# EAGLE design cociclo_05 (EAGLE 8.6.0)
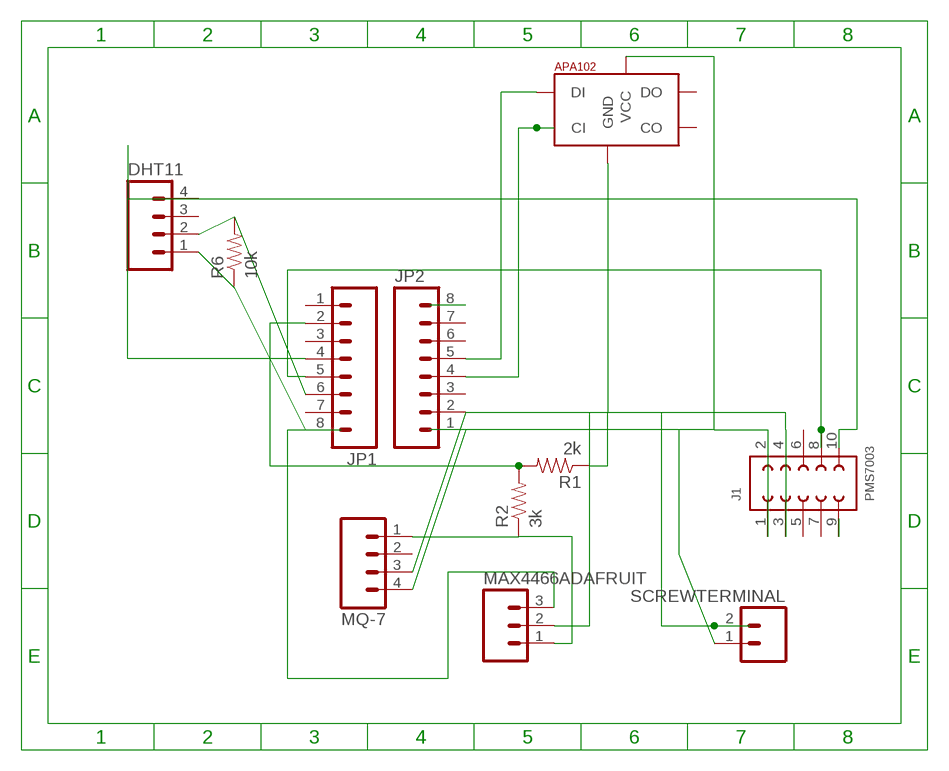
[diagram p0: schematic, sheet 1]

## Parts
DHT11  M04PTH  [1X04]
J1  PMS7003  621X1021021  [621X1021021]
JP1  M08  [1X08_ROUND]
JP2  M08  [1X08_ROUND]
MAX4466ADAFRUIT  M03PTH  [1X03]
MQ-7  M04PTH  [1X04]
R1  2k  RESISTOR1206  [1206]
R2  3k  RESISTOR1206  [1206]
R6  10k  RESISTOR1206  [1206]
SCREWTERMINAL  M023.5MM  [SCREWTERMINAL-3.5MM-2]
SK9822LED  APA1025050  [APA102_5050]

## Nets
7RX: J1.8 JP1.5
9TX: J1.10 JP1.4
10SET: J1.9
+5V: J1.1 J1.2 JP2.1 MQ-7.4 SCREWTERMINAL.1 SK9822LED.1(VCC)
ADC: JP1.2 R1.2 R2.2
CH_PD: DHT11.1 JP1.8 MAX4466ADAFRUIT.3 R6.1
D2: JP2.5 SK9822LED.4(DI)
GND: DHT11.4 J1.3 J1.4 JP2.2 MAX4466ADAFRUIT.2 MQ-7.3 R1.1 SCREWTERMINAL.2 SK9822LED.6(GND)
GPIO14: DHT11.2 JP1.6 R6.2
MQ7ANALOG: MAX4466ADAFRUIT.1 MQ-7.1 R2.1
N$10: JP2.4 SK9822LED.5(CI)
N$14: JP2.8
Unconnected: DHT11.3 J1.5 J1.6 J1.7 JP1.1 JP1.3 JP1.7 JP2.3 JP2.6 JP2.7 MQ-7.2 SK9822LED.2(CO) SK9822LED.3(DO)

## Library data of the parts
DHT11 MQ-7 = SparkFun-Connectors:M04: Header 4 Standard 4-pin 0.1" header. Use with straight break away headers (SKU : PRT-00116), right angle break away headers (PRT-00553), swiss pins (PRT-00743), machine pins (PRT-00117), and female headers (PRT-00115). Molex polarized connector foot print use with SKU : PRT-08231 with associated crimp pins and housings. 1MM SMD Version SKU: PRT-10208
J1 = Board-to-Board (rev18a):621X1021021: WR-PHD 1.27mm Dual SMT Pin Header H=3.80 mm, 10 Pins=>Code : Con_BTB_PHD_1.27_2_621x1021021(Packaging:x = 0: Tube x = 3: Tape & Reel with Cap) <http://katalog.we-online.de/media/thumbs2/eican/thb_Con_BTB_PHD_1.27_2_6210xx21021_pf2.jpg> 6210xx21021 Details see: http://katalog.we-online.de/en/em/621_0xx_210_21 6213xx21021 Details see: http://katalog.we-online.de/en/em/PHD_1_27_SMT_DUAL_PIN_HEADER_REEL_6213XX21021 2014 (C) Würth Elektronik
JP1 JP2 = SparkFun-Connectors:M08: Header 8 Standard 8-pin 0.1" header. Use with straight break away headers (SKU : PRT-00116), right angle break away headers (PRT-00553), swiss pins (PRT-00743), machine pins (PRT-00117), and female headers (PRT-00115).
MAX4466ADAFRUIT = SparkFun-Connectors:M03: Header 3 Standard 3-pin 0.1" header. Use with straight break away headers (SKU : PRT-00116), right angle break away headers (PRT-00553), swiss pins (PRT-00743), machine pins (PRT-00117), and female headers (PRT-00115). Molex polarized connector foot print use with SKU : PRT-08232 with associated crimp pins and housings.
R1 R2 R6 = SparkFun-Resistors:RESISTOR: Resistor Basic schematic elements and footprints for 0603, 1206, and PTH resistors.
SCREWTERMINAL = SparkFun-Connectors:M02: Standard 2-pin 0.1" header. Use with - straight break away headers ( PRT-00116) - right angle break away headers (PRT-00553) - swiss pins (PRT-00743) - machine pins (PRT-00117) - female headers (PRT-00115) Molex polarized connector foot print use with: PRT-08233 with associated crimp pins and housings. 2.54_SCREWTERM for use with PRT-10571. 3.5mm Screw Terminal footprints for PRT-08084 5mm Screw Terminal footprints for use with PRT-08432; PROD_ID: CONN-08399
SK9822LED = jos-ph:APA102: APA102C 5050 RGB LED -- Adafruit DotStar Single LED Pixel Product Page: https://www.adafruit.com/products/2343 Datasheet: https://cdn-shop.adafruit.com/product-files/2343/APA102C.pdf

## Board
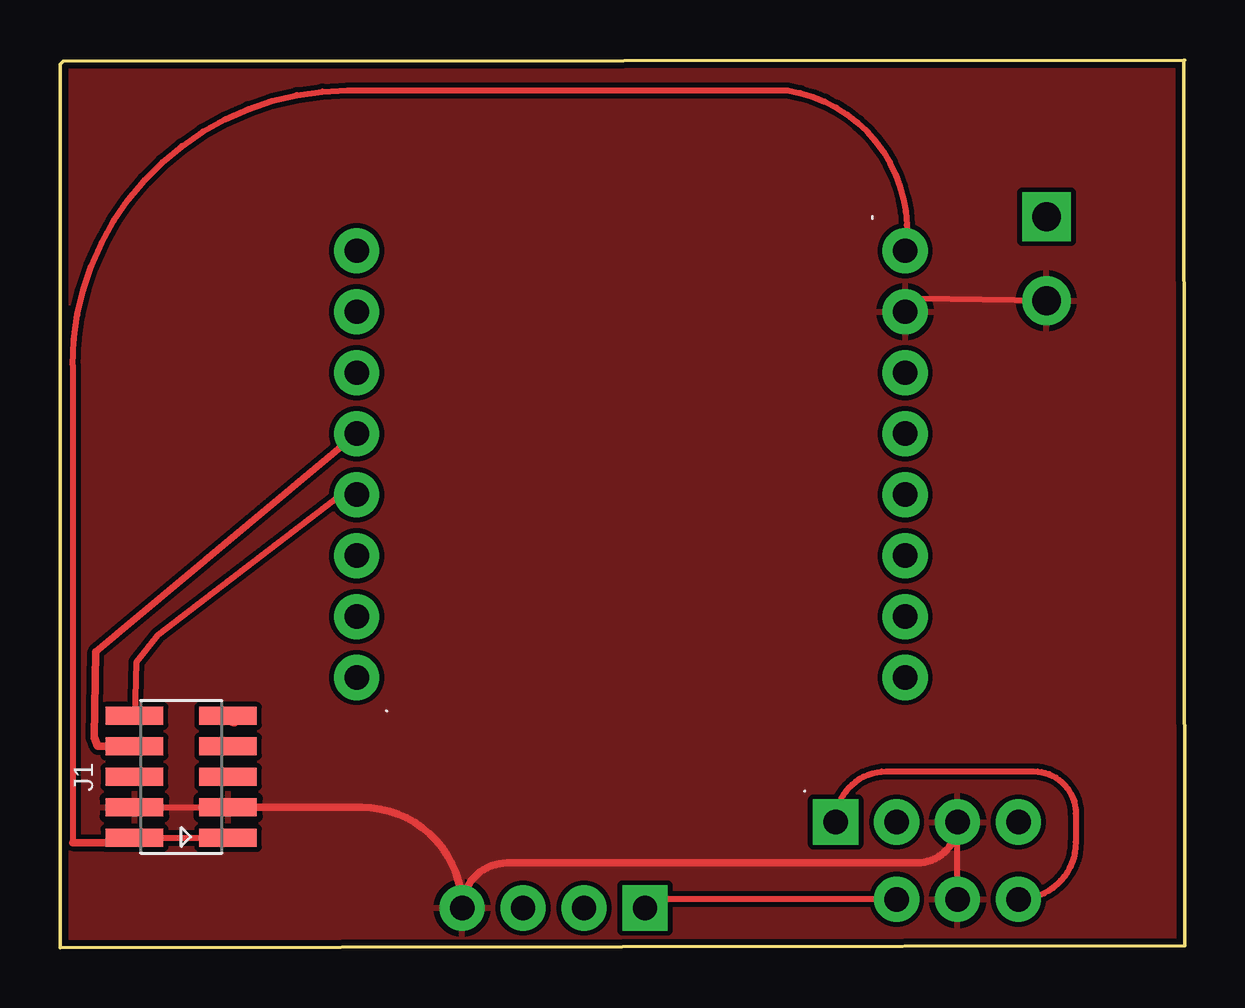
[diagram p1: board, top side]
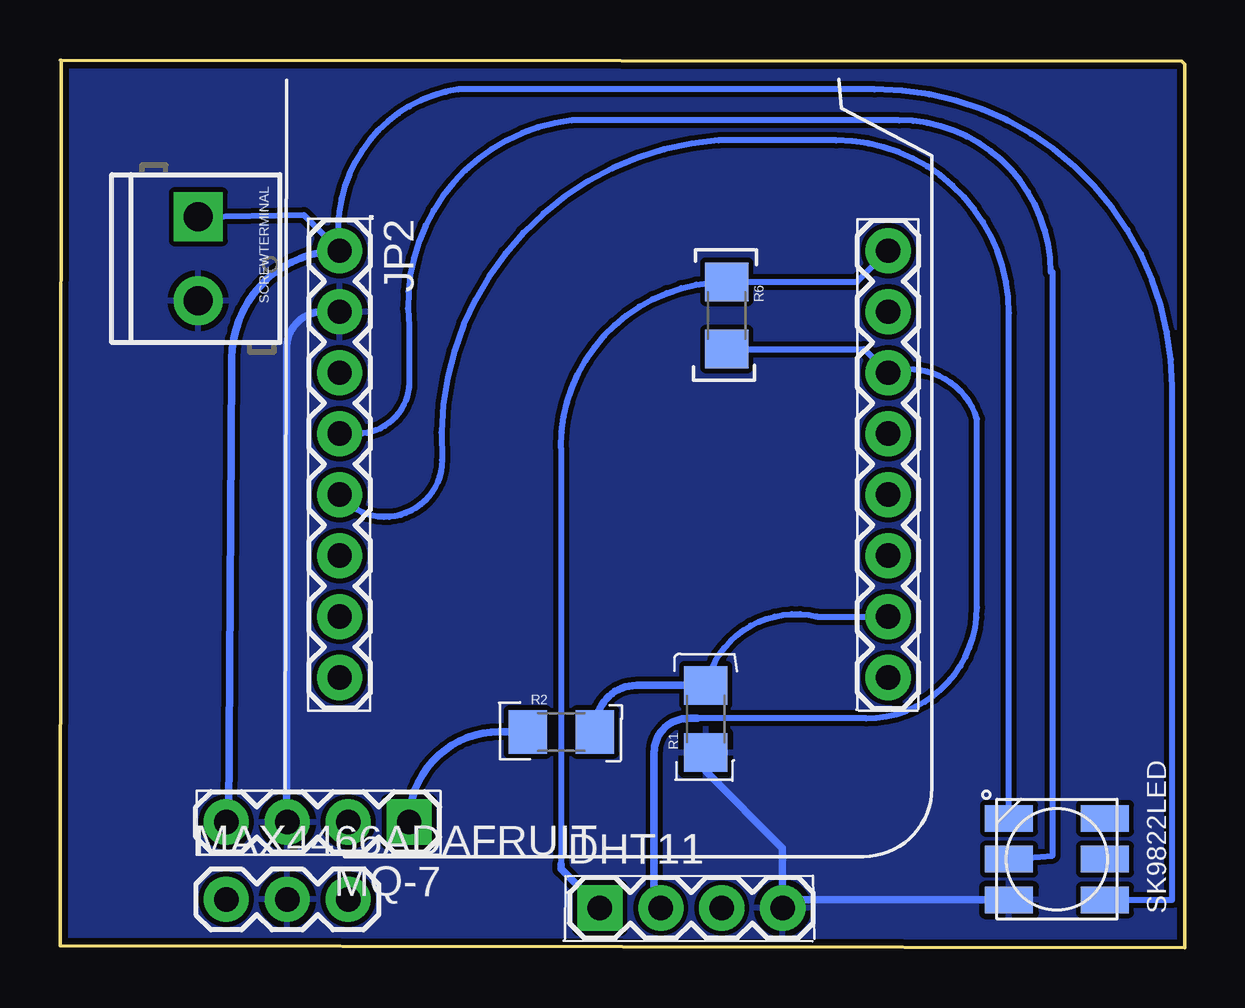
[diagram p2: board, bottom side, seen from below]

Size 46.89 x 36.98 mm. Coordinates in mm from the lower left corner, seen from the top.
Outline: 46.84,36.98 46.89,0.08 0,0 0,36.8 0.13,36.93 46.89,36.98
Copper layers (1*16): Top 0.035mm / dielectric 1.5mm / Bottom 0.035mm
Design rules "adafruit *": minimum track width 10mil, minimum drill 15.5mil, track to track 8mil, track to pad 8mil, pad to pad 8mil, via to via 8mil, smd to smd 8mil, copper to edge 10mil, drill to drill 8mil, minimum pad ring 10mil, minimum via ring 8mil, stop-mask expansion 2mil, vias tented up to drill 20mil, thermal gap 10mil

### Footprints (pad centres in the part's own frame; a part is rotated, then mirrored left to right if it is on the bottom)
1X04 = drill 1.016 pad 1.88 square: 1 0,0 | drill 1.016 pad 1.88: 2 2.54,0; 3 5.08,0; 4 7.62,0
621X1021021 = smd 0.75 x 2.4: 1 -2.54,-1.95; 2 -2.54,1.95; 3 -1.27,-1.95; 4 -1.27,1.95; 5 0,-1.95; 6 0,1.95; 7 1.27,-1.95; 8 1.27,1.95; 9 2.54,-1.95; 10 2.54,1.95
1X08_ROUND = drill 1.016 pad 1.88: 1 0,0; 2 2.54,0; 3 5.08,0; 4 7.62,0; 5 10.16,0; 6 12.7,0; 7 15.24,0; 8 17.78,0
1X03 = drill 1.016 pad 1.88: 1 0,0; 2 2.54,0; 3 5.08,0
1206 = smd 1.6 x 1.8: 1 -1.4,0; 2 1.4,0
SCREWTERMINAL-3.5MM-2 = drill 1.2 pad 2.032 square: 1 0,0 | drill 1.2 pad 2.032: 2 3.5,0
APA102_5050 = smd 2 x 1.1: 1 2,-1.7; 2 2,0; 3 2,1.7; 4 -2,1.7; 5 -2,0; 6 -2,-1.7

### Placement (x,y rotation side)
DHT11  24.38,1.65 0 bottom
J1  5.05,7.11 90 top
JP1  12.37,11.25 90 bottom
JP2  35.23,29.03 270 bottom
MAX4466ADAFRUIT  39.95,2.01 0 bottom
MQ-7  32.33,5.23 180 bottom
R1  19.97,9.52 90 bottom
R2  25.99,8.99 0 bottom
R6  19.1,26.34 270 bottom
SCREWTERMINAL  41.12,30.45 270 bottom
SK9822LED  5.33,3.68 0 bottom

### Tracks (layer width: path | path; a pad name or v marks a point on that pad's centre or on a via)
7RX
  Top 0.305: 3.03,8.31 J1.8 1.57,8.38 1.42,8.76 1.5,12.32 JP1.5
9TX
  Top 0.254: JP1.4 11.71,18.87 4.07,13.01 3.18,11.89 J1.10
10SET
  Top 0.305: 7.28,9.37 arc-90 J1.9
+5V
  Top 0.254: J1.2 3.3,4.57 J1.1 | 0.53,4.37 0.53,24.26 arc-90 11.99,35.71 30.33,35.71 arc-90 JP2.1
  Top 0.305: 0.53,4.37 3.1,4.37 arc90 3.3,4.57
  Bottom 0.254: SK9822LED.1 0.53,1.98 0.53,23.37 arc-90 12.93,35.76 30.28,35.76 arc-90 JP2.1 36.73,30.53 SCREWTERMINAL.1
  Bottom 0.305: MQ-7.4 arc-90 39.85,5.33 39.73,24.21 39.73,24.54 arc90 JP2.1
ADC
  Bottom 0.254: 24.64,9.15 24.68,9.1 | R1.2 arc90 15.32,13.79 JP1.2
  Bottom 0.305: R1.2 22.86,10.93 arc-90 24.56,9.22
  Bottom 0.61: 24.56,9.22 arc90 24.68,9.1 24.68,9.6 arc90 R2.2
CH_PD
  Top 0.254: MAX4466ADAFRUIT.3 24.74,2.01 arc90 DHT11.1
  Bottom 0.254: JP1.8 13.66,27.74 R6.1 arc-90 26.01,20.83 26.01,3.48
  Bottom 0.305: 26.01,3.48 26.01,3.28 DHT11.1
  Bottom 0.61: JP1.8 arc-90 11.98,28.64
D2
  Bottom 0.254: SK9822LED.4 7.33,26.44 arc-90 14.53,33.63 19.43,33.63 arc-90 30.96,20.32 arc143 JP2.5
GND
  Top 0.254: J1.4 J1.3 | MAX4466ADAFRUIT.2 MQ-7.3 | SCREWTERMINAL.2 35.77,27.03 JP2.2
  Top 0.305: DHT11.4 16.76,1.75 | DHT11.4 arc-90 18.64,3.53 35.71,3.53 arc90 MQ-7.3 | J1.3 12.57,5.84 arc-90 DHT11.4
  Bottom 0.254: R1.1 arc90 19.66,7.82
  Bottom 0.305: SK9822LED.6 16.43,1.98 DHT11.4 16.76,4.14 19.97,7.35 R1.1 | JP2.2 36.07,26.49 arc-90 37.44,24.79 37.44,5.26 arc-90 MQ-7.3
  pour Bottom: -0.04,-0.01 0.14,37.01 46.82,37.01 46.9,-0.01
  pour Top: -0.06,0.03 -0.03,36.98 46.81,36.91 46.87,0.12
GPIO14
  Bottom 0.254: R6.2 13.36,24.94 JP1.6 arc90 8.66,22.02 8.66,14.17 arc90 13.28,9.55 20.32,9.55
  Bottom 0.305: 20.32,9.55 20.7,9.55 arc-90 22.12,8.13 22.12,1.93 arc-90 DHT11.2
MQ7ANALOG
  Top 0.254: MQ-7.1 arc-90 34.44,7.34 40.59,7.34 arc-90 42.34,5.59 42.34,4.39 arc-90 MAX4466ADAFRUIT.1
  Bottom 0.305: R2.1 28.58,8.99 arc-90 MQ-7.1
N$10
  Bottom 0.254: SK9822LED.5 5.51,3.84 5.51,28.14 5.59,28.14 arc-90 11.91,34.47 25.55,34.47 arc-90 32.33,25.91 32.33,23.57 arc90 34.49,21.41 JP2.4

### Text on the board
uqam: v0.5
noms_b: V+ | 3V3 | V+ | D8 | G | G | D7 | 10k | D6 | D3 | D5 | D2 | D0 | D1 | A0 | RST | 2k | A0 | G | V+ | 3k | MQ-7 | G | D7 | 3V | MIC | DHT11 | 3V | A0
192bmp: /Users/uqam/Desktop/ohanda_logo.bmp
noms_t: G | DHT11 | D7 | 3V | A0 | D2 | D1 | SPKR | G | V+ | D2 | DEL | D3 | D7 | A0 | G | G | 3V3 | V+ | V+ | MQ-7 | V+ | V+ | G | G | PWR
200bmp: /Users/uqam/Desktop/Artengine_logo_petit_n_b.bmp | /Users/uqam/Desktop/cociclo_logo.bmp | /Users/uqam/Desktop/logo_unloquerVector_s.bmp